# Altium schematic sheet PMIC_2V5.SchDoc: 2.5V Power Supply
size B; CheckedBy: Jason Sullins; Author: Jordan Harris-Toovy; Revision: 0.2; SheetNumber: 12; SheetTotal: 22; Size: ANSI B
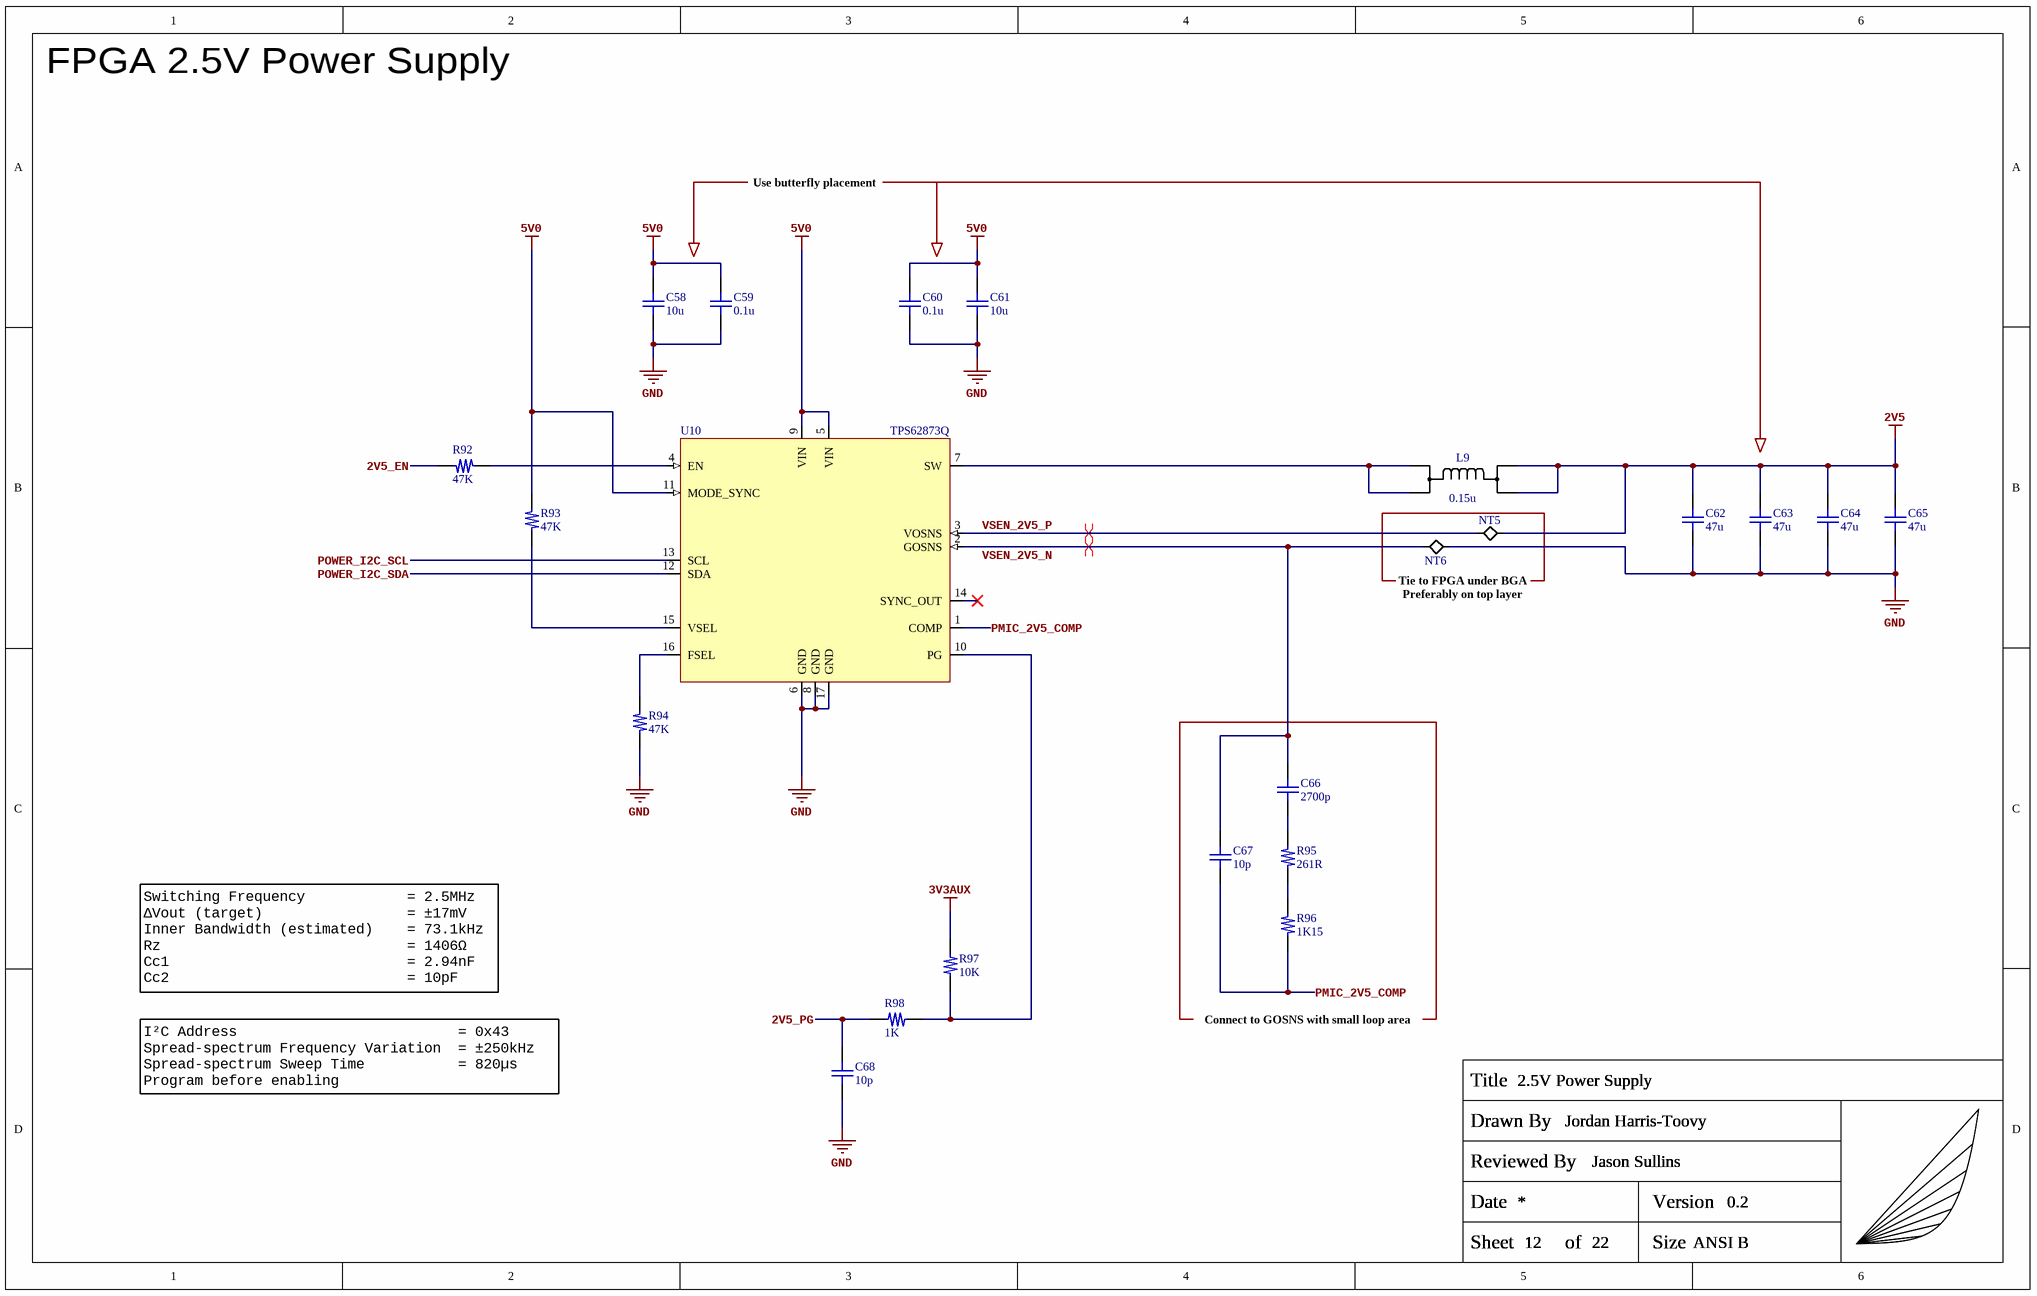
[diagram p0: PMIC_2V5.SchDoc]

## Parts
C58  10u  [C_0402_Generic]
C59  0.1u  [C_0402_Generic]
C60  0.1u  [C_0402_Generic]
C61  10u  [C_0402_Generic]
C62  47u  [C_0603_Generic]
C63  47u  [C_0603_Generic]
C64  47u  [C_0603_Generic]
C65  47u  [C_0603_Generic]
C66  2700p  [C_0402_Generic]
C67  10p  [C_0402_Generic]
C68  10p  [C_0402_Generic]
L9  0.15u  [TDK_CLT32]
NT5  NT  [SMD_NET_TIE]  (value not drawn)  (net tie, no BOM)
NT6  NT  [SMD_NET_TIE]  (value not drawn)  (net tie, no BOM)
R92  47K  [R_0402_Generic]
R93  47K  [R_0402_Generic]
R94  47K  [R_0402_Generic]
R95  261R  [R_0402_Generic]
R96  1K15  [R_0402_Generic]
R97  10K  [R_0402_Generic]
R98  1K  [R_0402_Generic]
TITLEBLOCK?  Capstone_Title_Block  (value not drawn)  (graphical)
U10  TPS62873Q  [TPS6287x-Q1]

## Nets
2V5: C62.2 C63.2 C64.2 C65.2 L9.3(P3) L9.4(P4) NT5.2(P2)
3V3AUX: R97.2
5V0: C58.2 C59.2 C60.2 C61.2 R93.2 U10.5(VIN) U10.9(VIN) U10.11(MODE_SYNC)
GND: C58.1 C59.1 C60.1 C61.1 C62.1 C63.1 C64.1 C65.1 C68.1 NT6.2(P2) R94.1 U10.6(GND) U10.8(GND) U10.17(GND)
2V5_EN: R92.2
2V5_PG: C68.2 R98.1
PMIC_2V5_COMP: C67.1 R96.1 U10.1(COMP)
POWER_I2C_SCL: U10.13(SCL)
POWER_I2C_SDA: U10.12(SDA)
VSEN_2V5_N: C66.2 C67.2 NT6.1(P1) U10.2(GOSNS)
VSEN_2V5_P: NT5.1(P1) U10.3(VOSNS)
NetC66_1: C66.1 R95.2
NetL9_1: L9.1(P1) L9.2(P2) U10.7(SW)
NetR92_1: R92.1 U10.4(EN)
NetR93_1: R93.1 U10.15(VSEL)
NetR94_2: R94.2 U10.16(FSEL)
NetR95_1: R95.1 R96.2
NetR97_1: R97.1 R98.2 U10.10(PG)

Not connected (* = marked no-connect by the designer): U10 14(SYNC_OUT)*

## Layout directives
differential pair; differential pair class DP_PMIC_SENSE: VSEN_2V5_N, VSEN_2V5_P

## Notes on the sheet
- FPGA 2.5V Power Supply
- Use butterfly placement
- Tie to FPGA under BGA
- Preferably on top layer
- Switching Frequency            = 2.5MHz
  ΔVout (target)                 = ±17mV
  Inner Bandwidth (estimated)    = 73.1kHz
  Rz                             = 1406Ω
  Cc1                            = 2.94nF
  Cc2                            = 10pF
- Connect to GOSNS with small loop area
- I²C Address                          = 0x43
  Spread-spectrum Frequency Variation  = ±250kHz
  Spread-spectrum Sweep Time           = 820µs
  Program before enabling
- (in symbol Capstone_Title_Block) Title; Drawn By; Reviewed By; Date; Version; Sheet; of; Size

## Library data of the parts
C58 C61 = CC0402MRX5R6BB106: 10µF 10V X5R SMD ceramic capacitor in 0402 size; Manufacturer: YAGEO; Manufacturer Part Number: CC0402MRX5R6BB106
C59 C60 = GRM155R71C104KA88D: 0.1µF 16V X7R SMD ceramic capacitor in 0402 size; Manufacturer: Murata Electronics; Manufacturer Part Number: GRM155R71C104KA88D
C62-C65 = GRM188R60J476ME15D: 47µF 6.3V X5R SMD ceramic capacitor in 0603 size; Manufacturer: Murata Electronics; Manufacturer Part Number: GRM188R60J476ME15D
C66 = GCM155R71H272KA37D: 2700pF 50V X7R SMD ceramic capacitor in 0402 size; Manufacturer: Murata Electronics; Manufacturer Part Number: GCM155R71H272KA37D
C67 C68 = GRM1555C1H100JA01D: 10pF 50V C0G/NP0 SMD ceramic capacitor in 0402 size; Manufacturer: Murata Electronics; Manufacturer Part Number: GRM1555C1H100JA01D
L9 = CLT3217N: Inductor 150nH 3.3mOhm 25.4A AEC-Q200, TDK; Manufacturer: EPCOS/TDK; Manufacturer Part Number: CLT32-17N
NT5 NT6 = Net_Tie_SMD: SMD Net Tie; Manufacturer: NONE; Manufacturer Part Number: NONE
R92-R94 = ERJ-2RKF4702X: 47KOhm 1% 1/10W SMD resistor in 0402 size; Manufacturer: Panasonic; Manufacturer Part Number: ERJ-2RKF4702X
R95 = ERJ-2RKF2610X: 261Ohm 1% 1/10W SMD resistor in 0402 size; Manufacturer: Panasonic; Manufacturer Part Number: ERJ-2RKF2610X
R96 = ERJ-2RKF1151X: 1.15KOhm 1% 1/10W SMD resistor in 0402 size; Manufacturer: Panasonic; Manufacturer Part Number: ERJ-2RKF1151X
R97 = ERJ-2RKF1002X: 10KOhm 1% 1/10W SMD resistor in 0402 size; Manufacturer: Panasonic; Manufacturer Part Number: ERJ-2RKF1002X
R98 = ERJ-2RKF1001X: 1KOhm 1% 1/10W SMD resistor in 0402 size; Manufacturer: Panasonic; Manufacturer Part Number: ERJ-2RKF1001X
TITLEBLOCK? = Capstone_Title_Block: Custom title block with personal logo; Manufacturer: NONE; Manufacturer Part Number: NONE
U10 = TPS62873QWRXSRQ1: Switching Voltage Regulators Automotive 2.7-V to 6-V input, 15-A, stackable, synchronous buck converter 16-VQFN-FCRLF -40 to 125C; Manufacturer: Texas Instruments; Manufacturer Part Number: TPS62873QWRXSRQ1